# Altium schematic sheet DB9串口定义.SchDoc
size A4
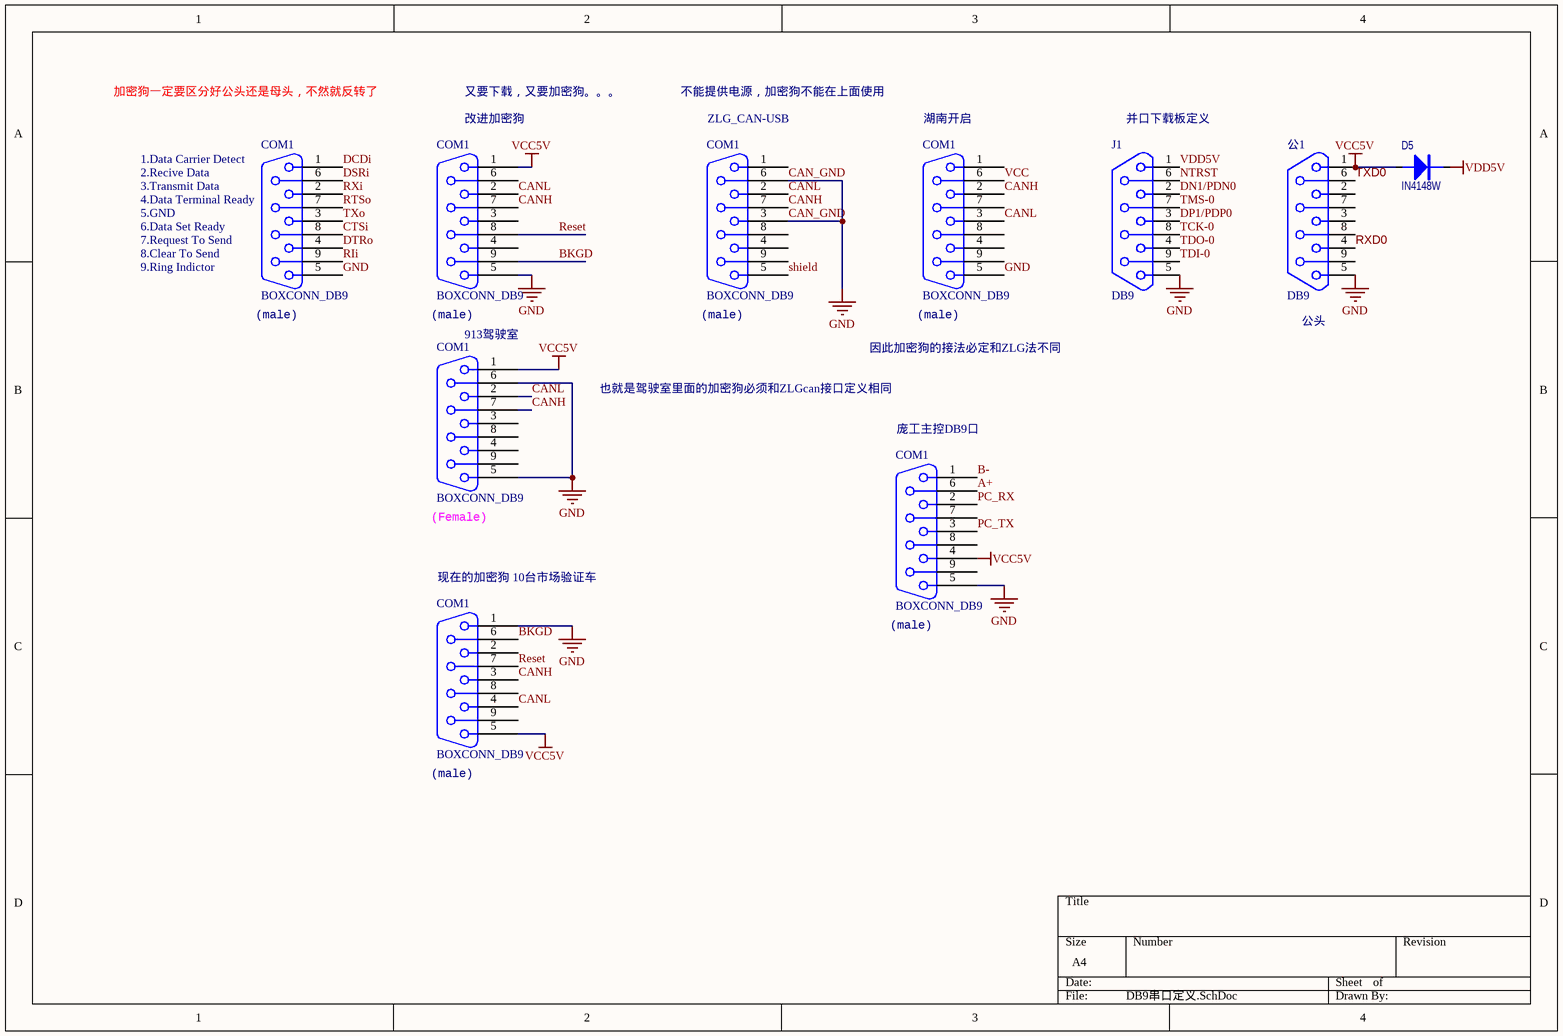
[diagram p0: DB9串口定义.SchDoc]

## Parts
(Parts that share a designator on the sheet are numbered #1, #2 ... from top to bottom, then left to right.)
COM1#1  BOXCONN_DB9  [DB9RA/M]
COM1#2  BOXCONN_DB9  [DB9RA/M]
COM1#3  BOXCONN_DB9  [DB9RA/M]
COM1#4  BOXCONN_DB9  [DB9RA/M]
COM1#5  BOXCONN_DB9  [DB9RA/M]
COM1#6  BOXCONN_DB9  [DB9RA/M]
COM1#7  BOXCONN_DB9  [DB9RA/M]
D5  IN4148W  [SOD123]
J1  DB9  [DB9Male]
公1  DB9  [DB9BSM]

## Nets
CAN_GND: COM1#1.5(GND) COM1#2.5(GND) COM1#3.3(TXD) COM1#3.6(DSR) COM1#4.5(GND) COM1#5.5(GND) COM1#5.6(DSR) COM1#6.5(GND) COM1#7.1(DCD) J1.5 公1.5  [also labelled GND]
VCC5V: COM1#2.1(DCD) COM1#5.1(DCD) COM1#6.4(DTR) COM1#7.5(GND) D5.1 公1.1
VDD5V: D5.2 J1.1
A+: COM1#6.6(DSR)
B-: COM1#6.1(DCD)
BKGD: COM1#2.9(RI) COM1#7.6(DSR)
CANH: COM1#2.7(RTS) COM1#3.7(RTS) COM1#4.2(RXD) COM1#5.7(RTS) COM1#7.3(TXD)
CANL: COM1#2.2(RXD) COM1#3.2(RXD) COM1#4.3(TXD) COM1#5.2(RXD) COM1#7.4(DTR)
CTSi: COM1#1.8(CTS)
DCDi: COM1#1.1(DCD)
DN1/PDN0: J1.2
DP1/PDP0: J1.3
DSRi: COM1#1.6(DSR)
DTRo: COM1#1.4(DTR)
NTRST: J1.6
PC_RX: COM1#6.2(RXD)
PC_TX: COM1#6.3(TXD)
Reset: COM1#2.8(CTS) COM1#7.7(RTS)
RIi: COM1#1.9(RI)
RTSo: COM1#1.7(RTS)
RXD0: 公1.4
RXi: COM1#1.2(RXD)
shield: COM1#3.5(GND)
TCK-0: J1.8
TDI-0: J1.9
TDO-0: J1.4
TMS-0: J1.7
TXD0: 公1.6
TXo: COM1#1.3(TXD)
VCC: COM1#4.6(DSR)

Not connected (* = marked no-connect by the designer): COM1#2 3(TXD) 4(DTR) 6(DSR); COM1#3 1(DCD) 4(DTR) 8(CTS) 9(RI); COM1#4 1(DCD) 4(DTR) 7(RTS) 8(CTS) 9(RI); COM1#5 3(TXD) 4(DTR) 8(CTS) 9(RI); COM1#6 7(RTS) 8(CTS) 9(RI); COM1#7 2(RXD) 8(CTS) 9(RI); 公1 2 3 7 8 9

## Notes on the sheet
- 加密狗一定要区分好公头还是母头，不然就反转了
- 又要下载，又要加密狗。。。
- 不能提供电源，加密狗不能在上面使用
- (near COM1#1) 1.Data Carrier Detect
- 2.Recive Data
- (near COM1#2) 改进加密狗
- (near COM1#3) ZLG_CAN-USB
- (near COM1#4) 湖南开启
- (near J1) 并口下载板定义
- 7.Request To Send
- 3.Transmit Data
- (near COM1#1) 4.Data Terminal Ready
- 6.Data Set Ready
- 5.GND
- 8.Clear To Send
- 9.Ring Indictor
- (near COM1#1) (male)
- (near COM1#2) (male)
- (near COM1#5) 913驾驶室
- (near COM1#3) (male)
- 因此加密狗的接法必定和ZLG法不同
- (near COM1#4) (male)
- (near 公1) 公头
- 也就是驾驶室里面的加密狗必须和ZLGcan接口定义相同
- (near COM1#6) 庞工主控DB9口
- (near COM1#5) (Female)
- (near COM1#7) 现在的加密狗 10台市场验证车
- (near COM1#6) (male)
- (near COM1#7) (male)

## Library data of the parts
COM1#1-COM1#7 = CONNECTOR DB9: Text Field1: 30; Text Field2: 100
D5 = DIODE